# Altium project GN-1866-A-V2_HI3519V101.PRJPCB (part 3 of 4)

## Sheet P05 Power 2.SchDoc
size 420 x 297 mm
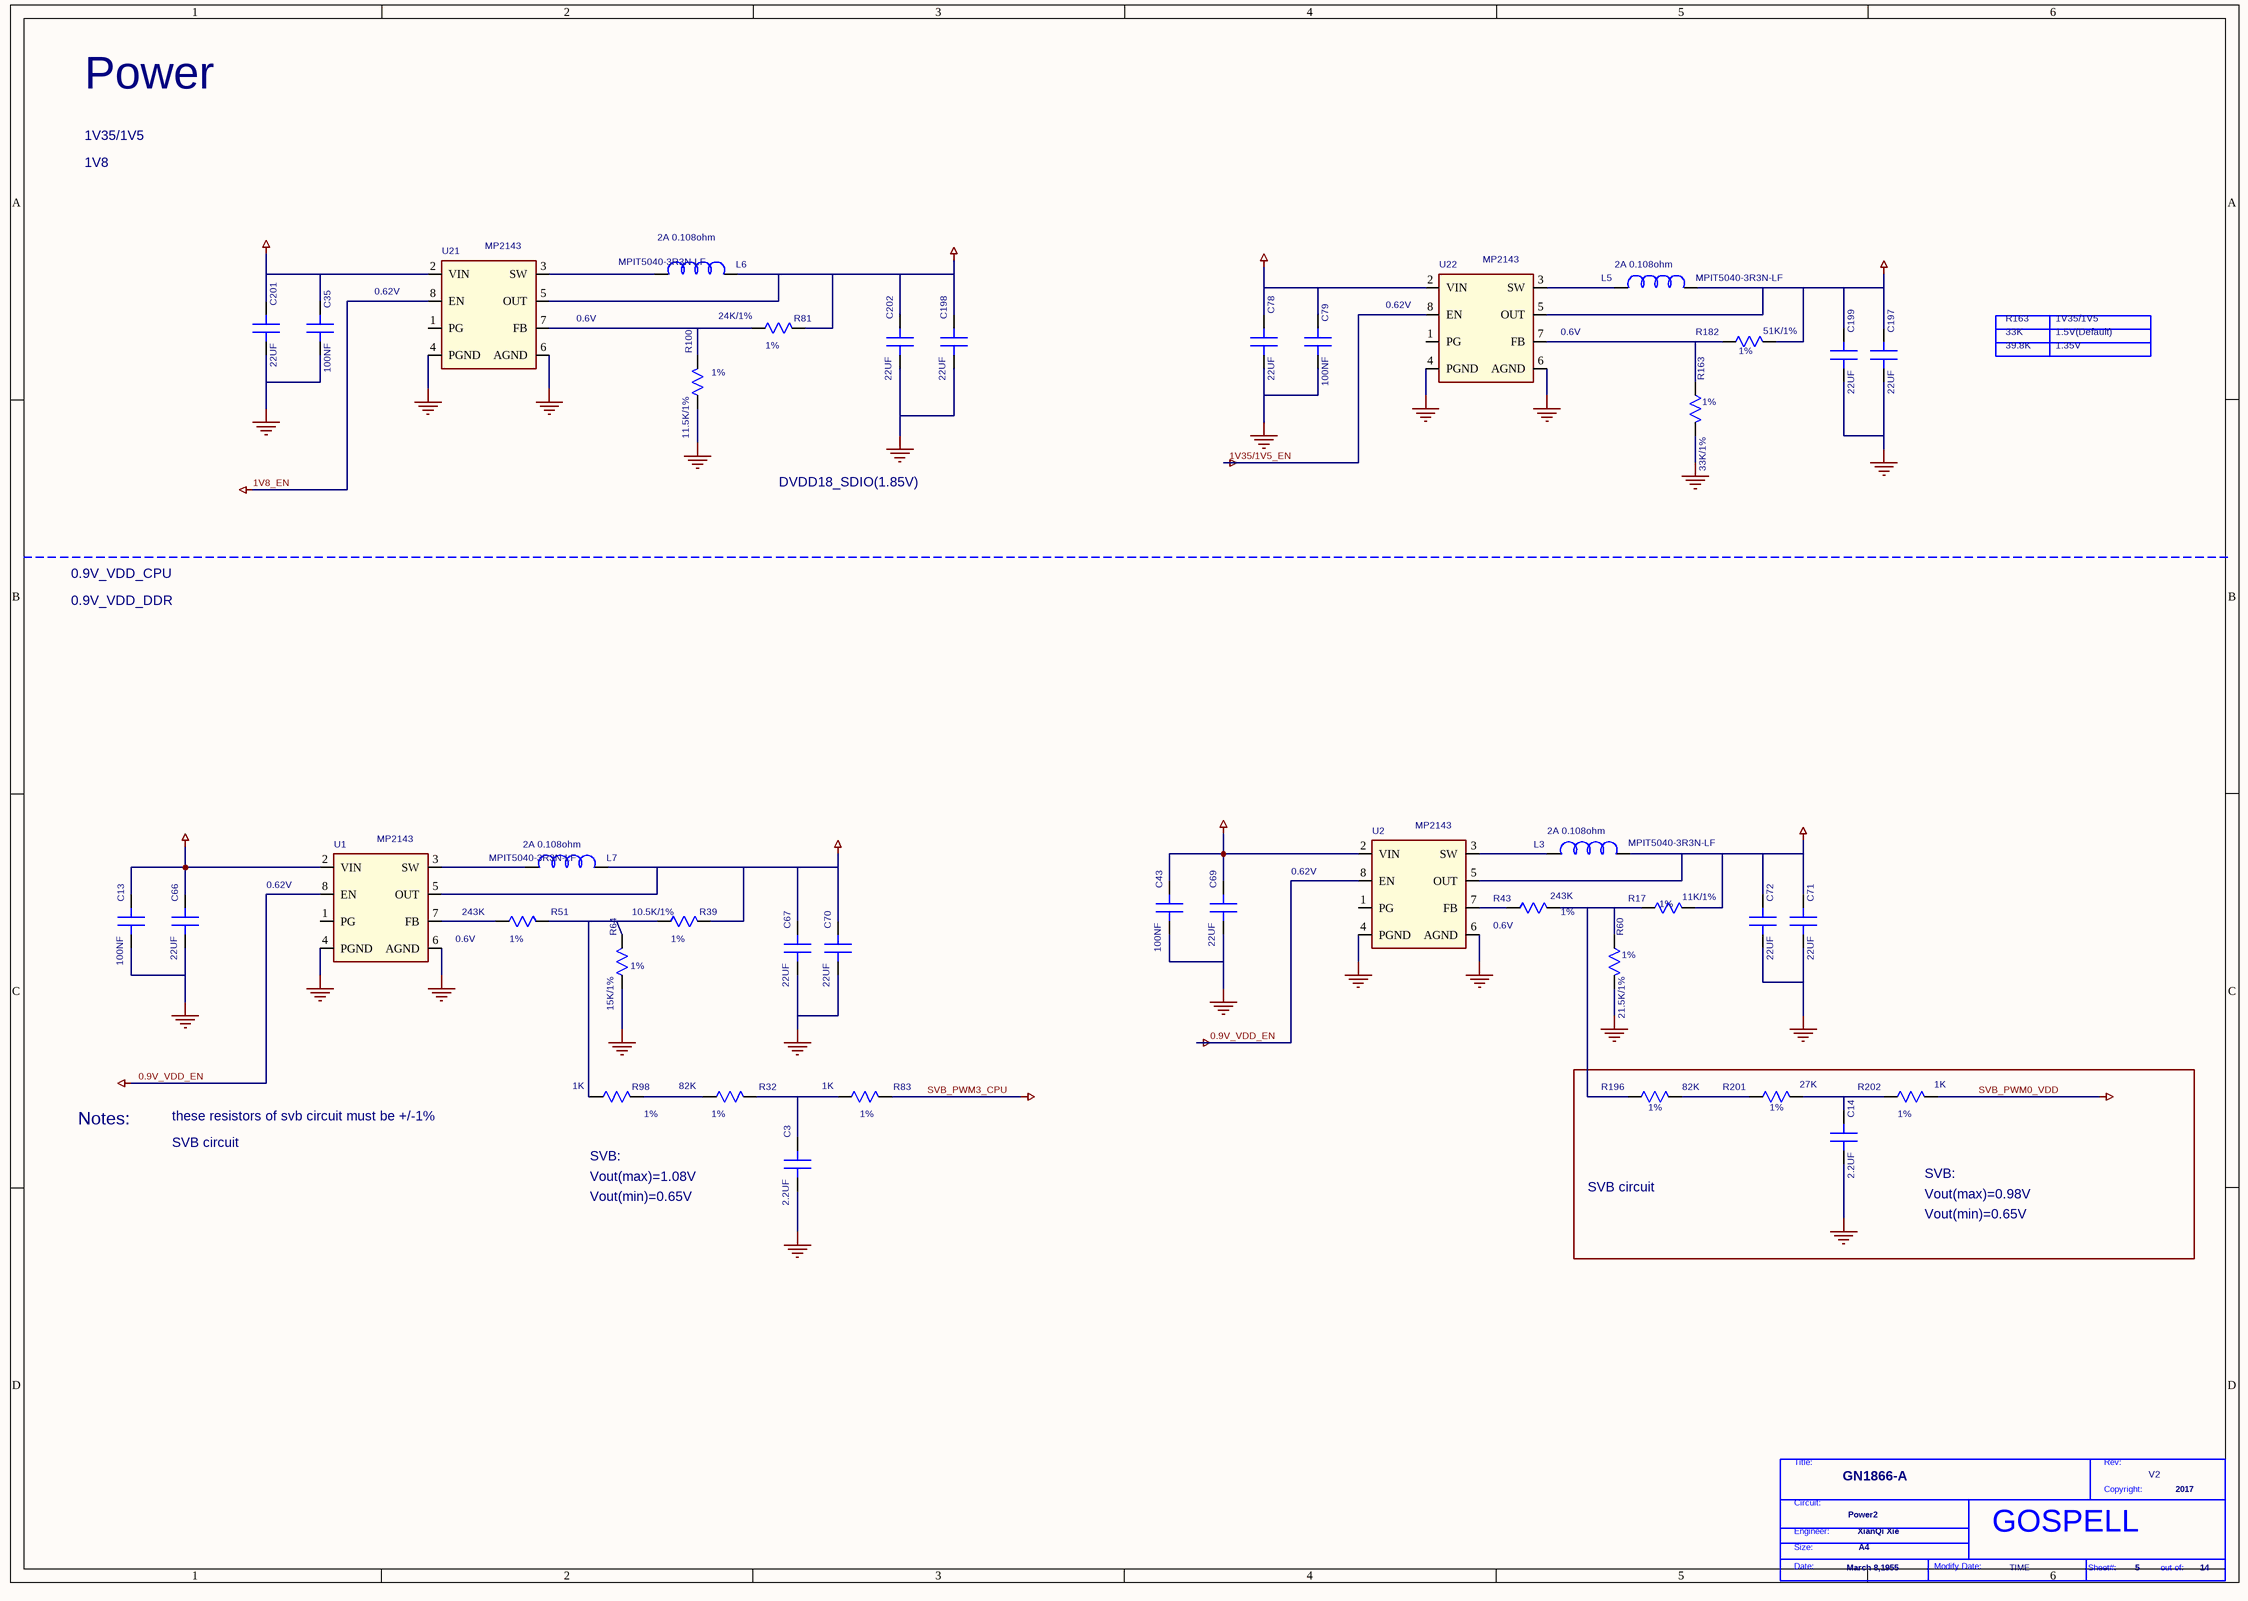
[diagram p9: P05 Power 2.SchDoc]

### Parts
(Parts that share a designator on the sheet are numbered #1, #2 ... from top to bottom, then left to right.)
*#10  Page Modify Date: TIME  Engineer: XianQi Xie  Copyright: 2017  Title: GN1866-A  RevCode: V2  Page Size: A4  Page Create Date: March 8,1955  Page Number: 5  Page Count: 14  Doc: Power2  (hidden comment: GOSPELL)  (graphical)
C3  2.2UF  [SC0402]
C13  100NF  [SC0402]
C14  2.2UF  [SC0402]
C35  100NF  [SC0402]
C43  100NF  [SC0402]
C66  22UF  [SC1206]
C67  22UF  [SC1206]
C69  22UF  [SC1206]
C70  22UF  [SC1206]
C71  22UF  [SC1206]
C72  22UF  [SC1206]
C78  22UF  [SC1206]
C79  100NF  [SC0402]
C197  22UF  [SC1206]
C198  22UF  [SC1206]
C199  22UF  [SC1206]
C201  22UF  [SC1206]
C202  22UF  [SC1206]
L3  MPIT5040-3R3N-LF  [MPI5040]
L5  MPIT5040-3R3N-LF  [MPI5040]
L6  MPIT5040-3R3N-LF  [MPI5040]
L7  MPIT5040-3R3N-LF  [MPI5040]
R17  11K/1%  [SR0402]
R32  82K  [SR0402]
R39  10.5K/1%  [SR0402]
R43  243K  [SR0402]
R51  243K  [SR0402]
R60  21.5K/1%  [SR0402]
R64  15K/1%  [SR0402]
R81  24K/1%  [SR0402]
R83  1K  [SR0402]
R98  1K  [SR0402]
R100  11.5K/1%  [SR0402]
R163  33K/1%  [SR0402]
R182  51K/1%  [SR0402]
R196  82K  [SR0402]
R201  27K  [SR0402]
R202  1K  [SR0402]
U1  DEVICE: MP2143  [TSOT23-8]  (hidden comment: MP2161GJ)
U2  DEVICE: MP2143  [TSOT23-8]  (hidden comment: MP2161GJ)
U21  DEVICE: MP2143  [TSOT23-8]  (hidden comment: MP2161GJ)
U22  DEVICE: MP2143  [TSOT23-8]  (hidden comment: MP2161GJ)

### Nets
0.9V_VDD_EN: U1.8(EN) U2.8(EN)
1V8: C198.1(A) C202.1(A) L6.1(A) R81.1(A) U21.5(OUT)
1V8_EN: U21.8(EN)
1V35/1V5: C197.1(A) C199.1(A) L5.1(A) R182.2(B) U22.5(OUT)
1V35/1V5_EN: U22.8(EN)
3V3: C13.1(A) C35.1(A) C43.1(A) C66.1(A) C69.1(A) C78.1(A) C79.1(A) C201.1(A) U1.2(VIN) U2.2(VIN) U21.2(VIN) U22.2(VIN)
GND: C3.2(B) C13.2(B) C14.2(B) C35.2(B) C43.2(B) C66.2(B) C67.2(B) C69.2(B) C70.2(B) C71.2(B) C72.2(B) C78.2(B) C79.2(B) C197.2(B) C198.2(B) C199.2(B) C201.2(B) C202.2(B) R60.2(B) R64.2(B) R100.2(B) R163.2(B) U1.4(PGND) U1.6(AGND) U2.4(PGND) U2.6(AGND) U21.4(PGND) U21.6(AGND) U22.4(PGND) U22.6(AGND)
SVB_PWM0_VDD: R202.2(B)
SVB_PWM3_CPU: R83.2(B)
VCC_CPU_CORE: C67.1(A) C70.1(A) L7.1(A) R39.1(A) U1.5(OUT)
VCC_VDD_DDR_CORE: C71.1(A) C72.1(A) L3.1(A) R17.2(B) U2.5(OUT)
NetC3_1: C3.1(A) R32.1(A) R83.1(A)
NetC14_1: C14.1(A) R201.2(B) R202.1(A)
NetL3_2: L3.2(B) U2.3(SW)
NetL5_2: L5.2(B) U22.3(SW)
NetL6_2: L6.2(B) U21.3(SW)
NetL7_2: L7.2(B) U1.3(SW)
NetR17_1: R17.1(A) R43.2(B) R60.1(A) R196.1(A)
NetR32_2: R32.2(B) R98.2(B)
NetR39_2: R39.2(B) R51.1(A) R64.1(A) R98.1(A)
NetR43_1: R43.1(A) U2.7(FB)
NetR51_2: R51.2(B) U1.7(FB)
NetR81_2: R81.2(B) R100.1(A) U21.7(FB)
NetR163_1: R163.1(A) R182.1(A) U22.7(FB)
NetR196_2: R196.2(B) R201.1(A)

Not connected (* = marked no-connect by the designer): U1 1(PG); U2 1(PG); U21 1(PG); U22 1(PG)

### Notes on the sheet
- Power
- 1V8
- 1V35/1V5
- (near L6) 2A 0.108ohm
- 0.62V
- (near U21) 0.6V
- (near U22) 0.62V
- (near L5) 2A 0.108ohm
- R163
- (near R100) 1%
- (near R81) 1%
- (near U22) 0.6V
- (near R182) 1%
- 39.8K
- 33K
- 1.5V(Default)
- 1.35V
- (near R163) 1%
- DVDD18_SDIO(1.85V)
- 0.9V_VDD_CPU
- 0.9V_VDD_DDR
- (near L7) 2A 0.108ohm
- (near L3) 2A 0.108ohm
- (near U1) 0.62V
- 0.6V
- (near R43) 1%
- (near R17) 1%
- (near R51) 1%
- (near R64) 1%
- (near R39) 1%
- (near R60) 1%
- Notes:
- these resistors of svb circuit must be +/-1%
- (near R98) 1%
- (near R32) 1%
- (near R83) 1%
- (near R196) 1%
- (near R201) 1%
- (near R202) 1%
- SVB circuit
- Vout(max)=1.08V
- SVB:
- Vout(min)=0.65V
- Vout(max)=0.98V
- (in symbol GOSPELL) Title:; Rev:; Copyright:; Circuit:; Engineer:; Size:; Date:; Modify Date:; Sheet#:; out of:

### Library data of the parts
C3 = C_0_Dup2: PARTS: 1; OriginalSymbolOrigin: (0,30); DEVICE: GRM155R60J225ME15D; PKG_TYPE: HSC0402; LEVEL: STD; PINSWAP: (A,B); %208%%161%%192%%224%%195%%251%%179%%198%: SMD陶瓷电容; COMPONENT_HIGH_MAX: 0.6MM; %182%%238%%182%%168%%185%%164%%215%%247%%181%%231%%209%%185%(V): 6.3; %195%%232%%202%%246%: SMD陶瓷电容-6.3V-2200NF-+/-20%-X5R-0402-TS16949; CODE: 8070667; GVALUE: C  6.3V  2.2uF +80%~-20%  X5R 0402
C13 C79 = C_0_Dup2: PARTS: 1; OriginalSymbolOrigin: (0,30); DEVICE: RMEMK105BJ104KV_FR; LEVEL: STD; PINSWAP: (A,B); GVALUE: C 16V  0.1uF +80%~-20%  X7R 0402; %208%%161%%192%%224%%195%%251%%179%%198%: SMD陶瓷电容; COMPONENT_HIGH_MAX: 0.55MM; %182%%238%%182%%168%%185%%164%%215%%247%%181%%231%%209%%185%(V): 16; %195%%232%%202%%246%: SMD陶瓷电容-16V-100NF-+/-10%-X7R-0402-BT; CODE: 8070614; PKG_TYPE: SC0402
C14 = C_0_Dup2: PARTS: 1; OriginalSymbolOrigin: (0,30); DEVICE: GRM155R60J225ME15D; PKG_TYPE: HSC0402; LEVEL: STD; PINSWAP: (A,B); GVALUE: C  6.3V  2.2uF +80%~-20%  X5R 0402; %208%%161%%192%%224%%195%%251%%179%%198%: SMD陶瓷电容; COMPONENT_HIGH_MAX: 0.6MM; %182%%238%%182%%168%%185%%164%%215%%247%%181%%231%%209%%185%(V): 6.3; %195%%232%%202%%246%: SMD陶瓷电容-6.3V-2200NF-+/-20%-X5R-0402-TS16949; CODE: 8070667
C35 C43 = C_0_Dup2: PARTS: 1; OriginalSymbolOrigin: (0,30); DEVICE: RMEMK105BJ104KV_FR; LEVEL: STD; PINSWAP: (A,B); GVALUE: C 16V  0.1uF +80%~-20%  X7R 0402; CODE: 8070614; %195%%232%%202%%246%: SMD陶瓷电容-16V-100NF-+/-10%-X7R-0402-BT; %182%%238%%182%%168%%185%%164%%215%%247%%181%%231%%209%%185%(V): 16; COMPONENT_HIGH_MAX: 0.55MM; %208%%161%%192%%224%%195%%251%%179%%198%: SMD陶瓷电容; PKG_TYPE: SC0402
C66 C71 C72 C78 C197-C199 = C_0_Dup2: PARTS: 1; OriginalSymbolOrigin: (0,30); DEVICE: GRM31CR60J226ME19L; LEVEL: STD; PINSWAP: (A,B); CODE: 8070630; %195%%232%%202%%246%: SMD陶瓷电容-6.3V-22000NF-+/-20%-X5R-1206-BT,TS16949; %182%%238%%182%%168%%185%%164%%215%%247%%181%%231%%209%%185%(V): 6.3; COMPONENT_HIGH_MAX: 1.9MM; %208%%161%%192%%224%%195%%251%%179%%198%: SMD陶瓷电容; GVALUE: C  6.3V  22uF +80%~-20%  X5R 1206; PKG_TYPE: SC1206
C67 C69 C70 C201 C202 = C_0_Dup2: PARTS: 1; OriginalSymbolOrigin: (0,30); DEVICE: GRM31CR60J226ME19L; LEVEL: STD; PINSWAP: (A,B); %208%%161%%192%%224%%195%%251%%179%%198%: SMD陶瓷电容; COMPONENT_HIGH_MAX: 1.9MM; %182%%238%%182%%168%%185%%164%%215%%247%%181%%231%%209%%185%(V): 6.3; %195%%232%%202%%246%: SMD陶瓷电容-6.3V-22000NF-+/-20%-X5R-1206-BT,TS16949; CODE: 8070630; GVALUE: C  6.3V  22uF +80%~-20%  X5R 1206; PKG_TYPE: SC1206
L3 = L_0: PARTS: 1; OriginalSymbolOrigin: (20,20); PKG_TYPE: HSL1008; LEVEL: STD; DEVICE: 1239AS_H_2R2N_P2; CODE: 10100175; %195%%232%%202%%246%: 终端功率电感-2.2UH-+/-30%-2A-0.108OHM-2.5*2.0*1.2MM-1008-2.2A; COMPONENT_HIGH_MAX: 1.2MM; %208%%161%%192%%224%%195%%251%%179%%198%: 终端功率电感; GVALUE: 麦捷:MPIT5040-3R3N-LF
L5-L7 = L_0: PARTS: 1; OriginalSymbolOrigin: (20,20); PKG_TYPE: HSL1008; LEVEL: STD; DEVICE: 1239AS_H_2R2N_P2; %208%%161%%192%%224%%195%%251%%179%%198%: 终端功率电感; COMPONENT_HIGH_MAX: 1.2MM; %195%%232%%202%%246%: 终端功率电感-2.2UH-+/-30%-2A-0.108OHM-2.5*2.0*1.2MM-1008-2.2A; CODE: 10100175; GVALUE: 麦捷:MPIT5040-3R3N-LF
R17 = R_0: PARTS: 1; OriginalSymbolOrigin: (10,20); PINSWAP: (A,B); DEVICE: RK73H1ETTP1102F; LEVEL: STD; %208%%161%%192%%224%%195%%251%%179%%198%: 片式厚膜电阻器; COMPONENT_HIGH_MAX: 0.4MM; %215%%232%%214%%181%%212%%202%%208%%237%%198%%171%%178%%238%: +/-1%; %182%%238%%182%%168%%185%%166%%194%%202%(W): 0.06; %195%%232%%202%%246%: 片式厚膜电阻器-0.0625W-11000OHM-+/-1%-0402-BT; CODE: 7091271; GVALUE: R 1/16W 11K±1% 0402; PKG_TYPE: SR0402
R32 = R_0: PARTS: 1; OriginalSymbolOrigin: (10,20); PINSWAP: (A,B); DEVICE: RC_02W8202FT; LEVEL: STD; %208%%161%%192%%224%%195%%251%%179%%198%: 片式厚膜电阻器; COMPONENT_HIGH_MAX: 0.4MM; %215%%232%%214%%181%%212%%202%%208%%237%%198%%171%%178%%238%: +/-1%; %182%%238%%182%%168%%185%%166%%194%%202%(W): 0.06; %195%%232%%202%%246%: 片式厚膜电阻器-0.0625W-82000OHM-+/-1%-0402; CODE: 7091388; GVALUE: R 1/16W 82K±5% 0402; PKG_TYPE: SR0402
R39 = R_0: PARTS: 1; OriginalSymbolOrigin: (10,20); PINSWAP: (A,B); DEVICE: RK73H1ETTP1102F; LEVEL: STD; CODE: 7091271; %195%%232%%202%%246%: 片式厚膜电阻器-0.0625W-11000OHM-+/-1%-0402-BT; %182%%238%%182%%168%%185%%166%%194%%202%(W): 0.06; %215%%232%%214%%181%%212%%202%%208%%237%%198%%171%%178%%238%: +/-1%; COMPONENT_HIGH_MAX: 0.4MM; %208%%161%%192%%224%%195%%251%%179%%198%: 片式厚膜电阻器; GVALUE: R 1/16W 10.5K±1% 0402; PKG_TYPE: SR0402
R43 R51 = R_0: PARTS: 1; OriginalSymbolOrigin: (10,20); PINSWAP: (A,B); DEVICE: RC_02W2433FT; LEVEL: STD; %208%%161%%192%%224%%195%%251%%179%%198%: 片式厚膜电阻器; COMPONENT_HIGH_MAX: 0.4MM; %215%%232%%214%%181%%212%%202%%208%%237%%198%%171%%178%%238%: +/-1%; %182%%238%%182%%168%%185%%166%%194%%202%(W): 0.06; %195%%232%%202%%246%: 片式厚膜电阻器-0.0625W-243000OHM-+/-1%-0402; CODE: 7091392; GVALUE: R 1/16W 200K±1% 0402; PKG_TYPE: SR0402
R60 = R_0: PARTS: 1; OriginalSymbolOrigin: (10,20); PINSWAP: (A,B); DEVICE: RC_02W2152FT; LEVEL: STD; CODE: 7091375; %195%%232%%202%%246%: 片式厚膜电阻器-0.0625W-21500OHM-+/-1%-0402; %182%%238%%182%%168%%185%%166%%194%%202%(W): 0.06; %215%%232%%214%%181%%212%%202%%208%%237%%198%%171%%178%%238%: +/-1%; COMPONENT_HIGH_MAX: 0.4MM; %208%%161%%192%%224%%195%%251%%179%%198%: 片式厚膜电阻器; GVALUE: R 1/16W 21.5K±1% 0402; PKG_TYPE: SR0402
R64 = R_0: PARTS: 1; OriginalSymbolOrigin: (10,20); PINSWAP: (A,B); DEVICE: KOARK73H1ETTP1692F; LEVEL: STD; CODE: 7091428; %195%%232%%202%%246%: 片式厚膜电阻器-0.0625W-16900OHM-+/-1%-0402-供电专用-供电专用; %182%%238%%182%%168%%185%%166%%194%%202%(W): 0.06; %215%%232%%214%%181%%212%%202%%208%%237%%198%%171%%178%%238%: +/-1%; COMPONENT_HIGH_MAX: 0.4MM; %208%%161%%192%%224%%195%%251%%179%%198%: 片式厚膜电阻器; GVALUE: R 1/16W 15K±1% 0402; PKG_TYPE: SR0402
R81 = R_0: PARTS: 1; OriginalSymbolOrigin: (10,20); PINSWAP: (A,B); DEVICE: RC0402FR_07604KL; LEVEL: STD; %208%%161%%192%%224%%195%%251%%179%%198%: 片式厚膜电阻器; COMPONENT_HIGH_MAX: 0.4MM; %215%%232%%214%%181%%212%%202%%208%%237%%198%%171%%178%%238%: +/-1%; %182%%238%%182%%168%%185%%166%%194%%202%(W): 0.06; %195%%232%%202%%246%: 片式厚膜电阻器-0.0625W-604000OHM-+/-1%-0402; CODE: 7091280; GVALUE: R 1/16W 24K±1% 0402; PKG_TYPE: SR0402
R83 R98 R202 = R_0: PARTS: 1; OriginalSymbolOrigin: (10,20); PINSWAP: (A,B); DEVICE: RC0402FR_071KL; LEVEL: STD; CODE: 7091282; %195%%232%%202%%246%: 片式厚膜电阻器-0.0625W-1000OHM-+/-1%-0402-BT; %182%%238%%182%%168%%185%%166%%194%%202%(W): 0.06; COMPONENT_HIGH_MAX: 0.4MM; %208%%161%%192%%224%%195%%251%%179%%198%: 片式厚膜电阻器; %215%%232%%214%%181%%212%%202%%208%%237%%198%%171%%178%%238%: +/-1%; GVALUE: R 1/16W 1K±5% 0402; PKG_TYPE: SR0402
R100 = R_0: PARTS: 1; OriginalSymbolOrigin: (10,20); PINSWAP: (A,B); DEVICE: RC_02W3013FT; LEVEL: STD; CODE: 7091393; %195%%232%%202%%246%: 片式厚膜电阻器-0.0625W-301000OHM-+/-1%-0402; %182%%238%%182%%168%%185%%166%%194%%202%(W): 0.06; %215%%232%%214%%181%%212%%202%%208%%237%%198%%171%%178%%238%: +/-1%; COMPONENT_HIGH_MAX: 0.4MM; %208%%161%%192%%224%%195%%251%%179%%198%: 片式厚膜电阻器; GVALUE: R 1/16W 11.5K±1% 0402; PKG_TYPE: SR0402
R163 = R_0: PARTS: 1; OriginalSymbolOrigin: (10,20); PINSWAP: (A,B); DEVICE: RC0402FR_07200KL; LEVEL: STD; CODE: 7091442; %195%%232%%202%%246%: 片式厚膜电阻器-0.0625W-200000OHM-+/- 1%-0402-供电专用-供电专用; %182%%238%%182%%168%%185%%166%%194%%202%(W): 0.06; %215%%232%%214%%181%%212%%202%%208%%237%%198%%171%%178%%238%: +/- 1%; COMPONENT_HIGH_MAX: 0.4MM; %208%%161%%192%%224%%195%%251%%179%%198%: 片式厚膜电阻器; GVALUE: R 1/16W 33K±1% 0402; PKG_TYPE: SR0402
R182 = R_0: PARTS: 1; OriginalSymbolOrigin: (10,20); PINSWAP: (A,B); DEVICE: RC_02W3013FT; LEVEL: STD; CODE: 7091393; %195%%232%%202%%246%: 片式厚膜电阻器-0.0625W-301000OHM-+/-1%-0402; %182%%238%%182%%168%%185%%166%%194%%202%(W): 0.06; %215%%232%%214%%181%%212%%202%%208%%237%%198%%171%%178%%238%: +/-1%; COMPONENT_HIGH_MAX: 0.4MM; %208%%161%%192%%224%%195%%251%%179%%198%: 片式厚膜电阻器; GVALUE: R 1/16W 51K±1% 0402; PKG_TYPE: SR0402
R196 = R_0: PARTS: 1; OriginalSymbolOrigin: (10,20); PINSWAP: (A,B); DEVICE: RC_02W8202FT; LEVEL: STD; CODE: 7091388; %195%%232%%202%%246%: 片式厚膜电阻器-0.0625W-82000OHM-+/-1%-0402; %182%%238%%182%%168%%185%%166%%194%%202%(W): 0.06; %215%%232%%214%%181%%212%%202%%208%%237%%198%%171%%178%%238%: +/-1%; COMPONENT_HIGH_MAX: 0.4MM; %208%%161%%192%%224%%195%%251%%179%%198%: 片式厚膜电阻器; GVALUE: R 1/16W 82K±5% 0402; PKG_TYPE: SR0402
R201 = R_0: PARTS: 1; OriginalSymbolOrigin: (10,20); PINSWAP: (A,B); DEVICE: RK73H1JTTD2702F; PKG_TYPE: SR0603; LEVEL: STD; CODE: 7090937; %195%%232%%202%%246%: 片式厚膜电阻器-0.1W-27000OHM-+/-1%-0603; %182%%238%%182%%168%%185%%166%%194%%202%(W): 0.1; %215%%232%%214%%181%%212%%202%%208%%237%%198%%171%%178%%238%: +/-1%; COMPONENT_HIGH_MAX: 0.55MM; %208%%161%%192%%224%%195%%251%%179%%198%: 片式厚膜电阻器; GVALUE: R 1/16W 27K±5% 0402
U1 U2 = MP2161GJ_0: PARTS: 1; OriginalSymbolOrigin: (20,90); LEVEL: STD; CODE: HBVT4016; COMPONENT_HIGH_MAX: 1MM; GVALUE: 电源调整管 MP2161GJ TSOT23-8; FORWARD_PCB: 1; %195%%232%%202%%246%: MP2143; PKG_TYPE: TSOT23-8
U21 U22 = MP2161GJ_0: PARTS: 1; OriginalSymbolOrigin: (20,90); LEVEL: STD; COMPONENT_HIGH_MAX: 1MM; CODE: HBVT4016; GVALUE: 电源调整管 MP2161GJ TSOT23-8; FORWARD_PCB: 1; PKG_TYPE: TSOT23-8; %195%%232%%202%%246%: MP2143
*#10 = GOSPELL: Cage Code: 2017